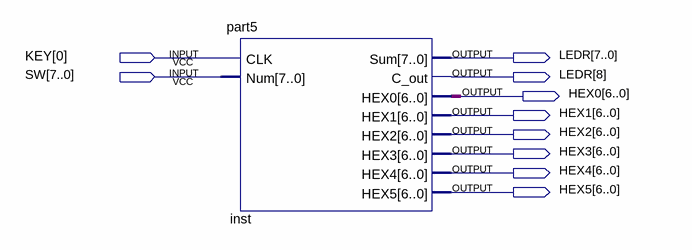
[diagram p0: schematic sheet]
// Quartus schematic part5_sch.bdf as structural Verilog: 1 symbols, 10 pins
module part5_sch (
  input  [0:0] KEY,
  input  [7:0] SW,
  output [8:0] LEDR,
  output [6:0] HEX0,
  output [6:0] HEX1,
  output [6:0] HEX2,
  output [6:0] HEX3,
  output [6:0] HEX4,
  output [6:0] HEX5
);

  part5 inst (
    .CLK(KEY[0]), .Num(SW), .Sum(LEDR[7:0]), .C_out(LEDR[8]), .HEX0(HEX0), .HEX1(HEX1), .HEX2(HEX2),
    .HEX3(HEX3), .HEX4(HEX4), .HEX5(HEX5));
endmodule
